# EAGLE design I2C Expansion Board v0.1A (EAGLE 9.3.1)
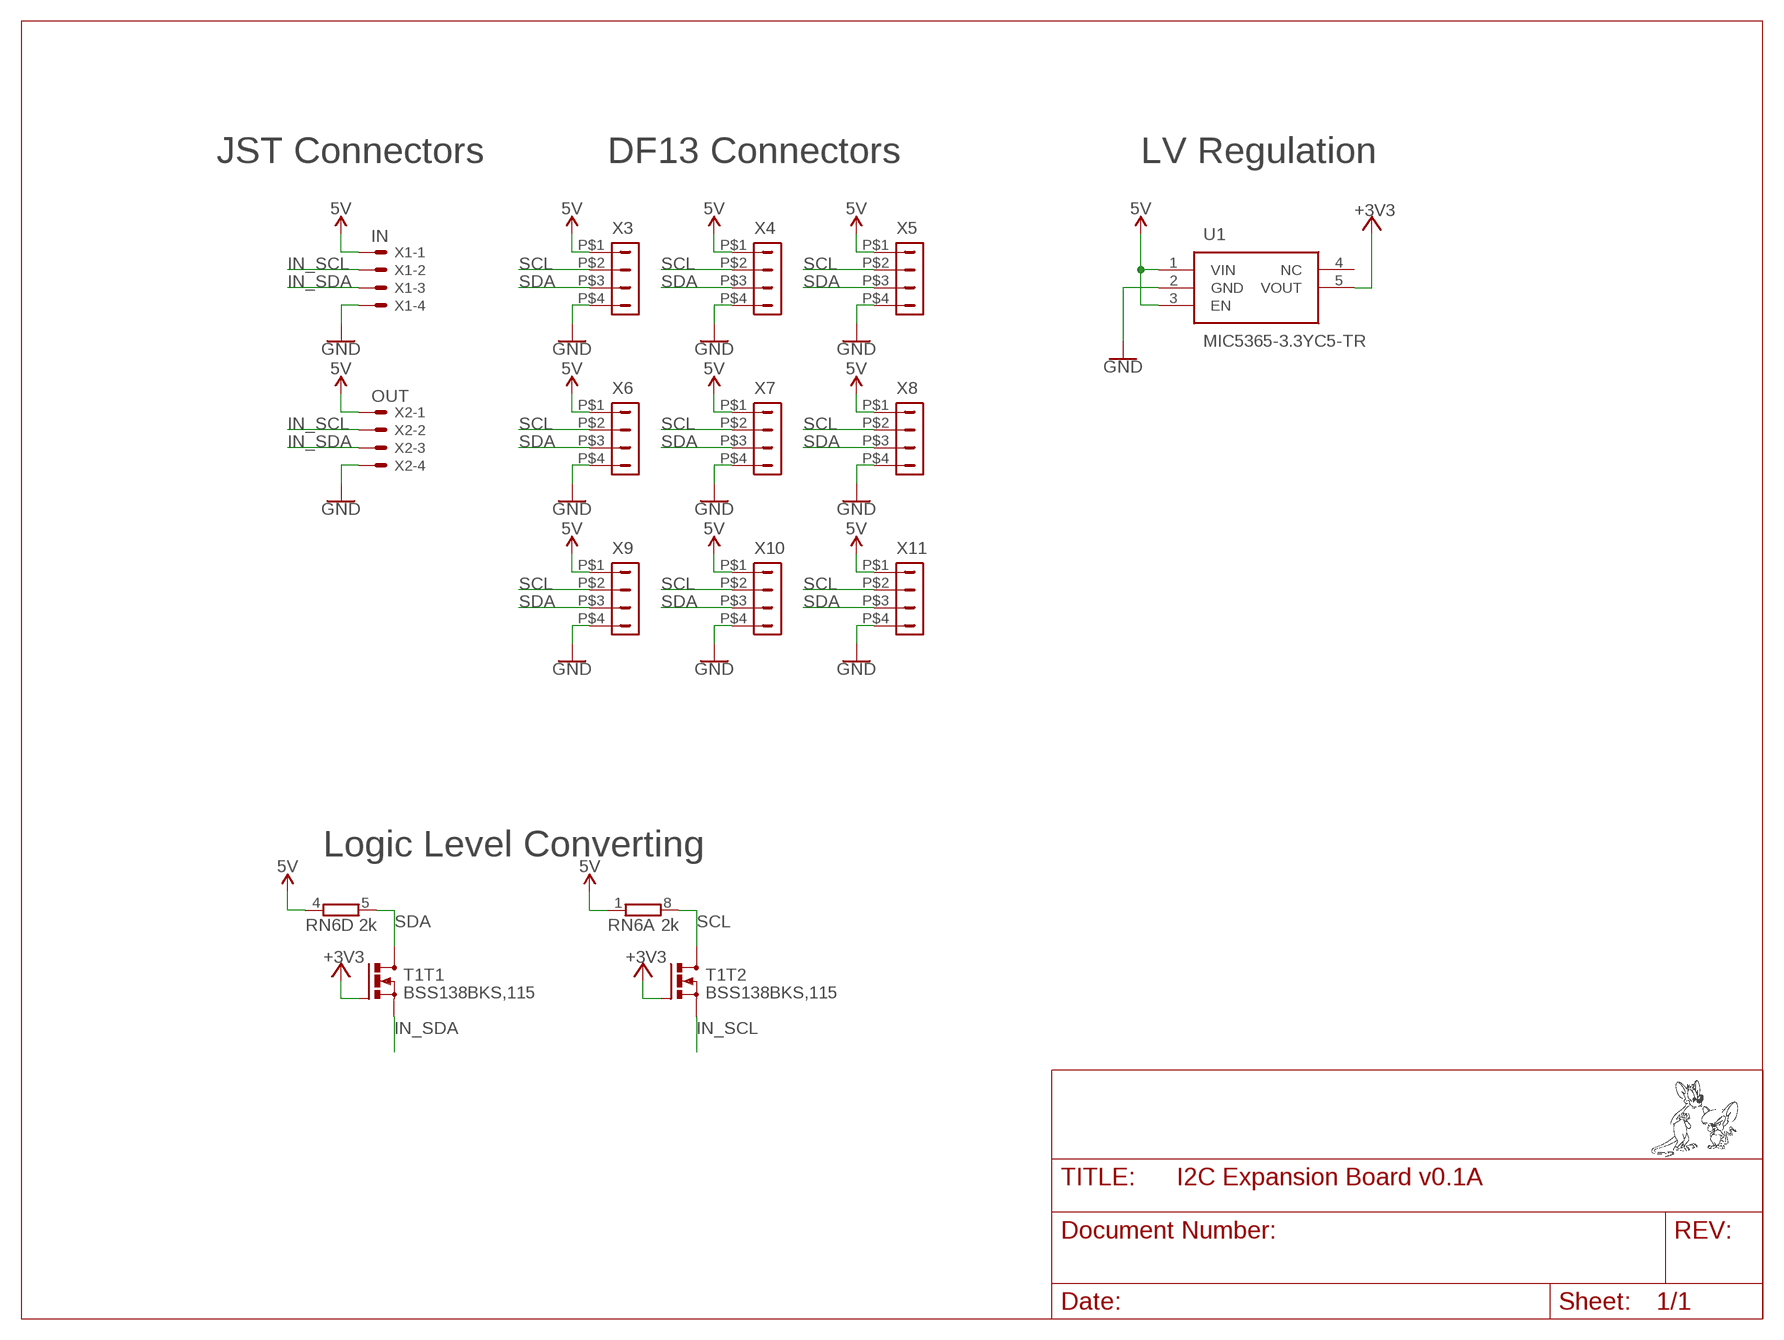
[diagram p0: schematic, sheet 1]

## Parts
RN6  2k  4R-NEXB28V  [EXB28V]
T1  BSS138BKS,115  [SOT363]
U1  MIC5365-3.3YC5-TR  [SOT65P210X110-5N]
X1  IN  JST-XH-04-PIN-LONG-PAD  [JST-XH-04-PACKAGE-LONG-PAD]
X2  OUT  JST-XH-04-PIN-LONG-PAD  [JST-XH-04-PACKAGE-LONG-PAD]
X3  DF13-4P-1.25DSA  [DF13-4P-1.25DSA]
X4  DF13-4P-1.25DSA  [DF13-4P-1.25DSA]
X5  DF13-4P-1.25DSA  [DF13-4P-1.25DSA]
X6  DF13-4P-1.25DSA  [DF13-4P-1.25DSA]
X7  DF13-4P-1.25DSA  [DF13-4P-1.25DSA]
X8  DF13-4P-1.25DSA  [DF13-4P-1.25DSA]
X9  DF13-4P-1.25DSA  [DF13-4P-1.25DSA]
X10  DF13-4P-1.25DSA  [DF13-4P-1.25DSA]
X11  DF13-4P-1.25DSA  [DF13-4P-1.25DSA]

## Nets
5V: RN6.1 RN6.4 U1.1(VIN) U1.3(EN) X1.1 X2.1 X3.P$1 X4.P$1 X5.P$1 X6.P$1 X7.P$1 X8.P$1 X9.P$1 X10.P$1 X11.P$1
+3V3: T1.2(T1:G) T1.5(T2:G) U1.5(VOUT)
GND: U1.2(GND) X1.4 X2.4 X3.P$4 X4.P$4 X5.P$4 X6.P$4 X7.P$4 X8.P$4 X9.P$4 X10.P$4 X11.P$4
IN_SCL: T1.4(T2:S) X1.2 X2.2
IN_SDA: T1.1(T1:S) X1.3 X2.3
SCL: RN6.8 T1.3(T2:D) X3.P$2 X4.P$2 X5.P$2 X6.P$2 X7.P$2 X8.P$2 X9.P$2 X10.P$2 X11.P$2
SDA: RN6.5 T1.6(T1:D) X3.P$3 X4.P$3 X5.P$3 X6.P$3 X7.P$3 X8.P$3 X9.P$3 X10.P$3 X11.P$3
Unconnected: RN6.2 RN6.3 RN6.6 RN6.7 U1.4(NC)

## Notes on the sheet
- JST Connectors | DF13 Connectors | LV Regulation
- Logic Level Converting

## Library data of the parts
RN6 = resistor-dil:4R-N: Array Chip Resistor Source: RS Component / Phycomp; OC_FARNELL: unknown; OC_NEWARK: unknown
T1 = BSS138BKS_115:BSS138BKS,115; AVAILABILITY: Unavailable; DESCRIPTION: Dual N-Channel 60 V 1.6 Ohm 445 mW 0.6 nC Surface Mount Trench MOSFET - TSSOP-6; MF: Nexperia USA; MP: BSS138BKS,115; PACKAGE: SOT-363 Nexperia; PRICE: None
U1 = MIC5365-3.3YC5-TR:MIC5365-3.3YC5-TR: MICROCHIP - MIC5365-3.3YC5-TR - LDO, FIXED, 3.3V, 0.15A, SC-70-5 Source: Datasheet <http://www.mouser.com/ds/2/268/mic5365-779177.pdf>; DESCRIPTION: MICROCHIP - MIC5365-3.3YC5-TR - LDO, FIXED, 3.3V, 0.15A, SC-70-5; HEIGHT: 1.1mm; MANUFACTURER_NAME: Microchip; MANUFACTURER_PART_NUMBER: MIC5365-3.3YC5-TR; MOUSER_PART_NUMBER: 998-MIC5365-3.3YC5TR; RS_PART_NUMBER: 1773258P; RS_PRICE-STOCK: http://uk.rs-online.com/web/p/products/1773258P
X1 X2 = Rembrandt Electronics - JST XH Connectors v1-0:JST-XH-04-PIN: JST XH Connector 2 Pin Wire to board connector. Pitch: 2,54 mm, (0.100") Number of pins: 4 Created by Rembrandt Electronics www.rembrandtelectronics.com
X3-X11 = con-hirose-df13:DF13-4P-1.25: DF13-4P 1.25mm Pitch Miniature Crimping Connector.

## Board
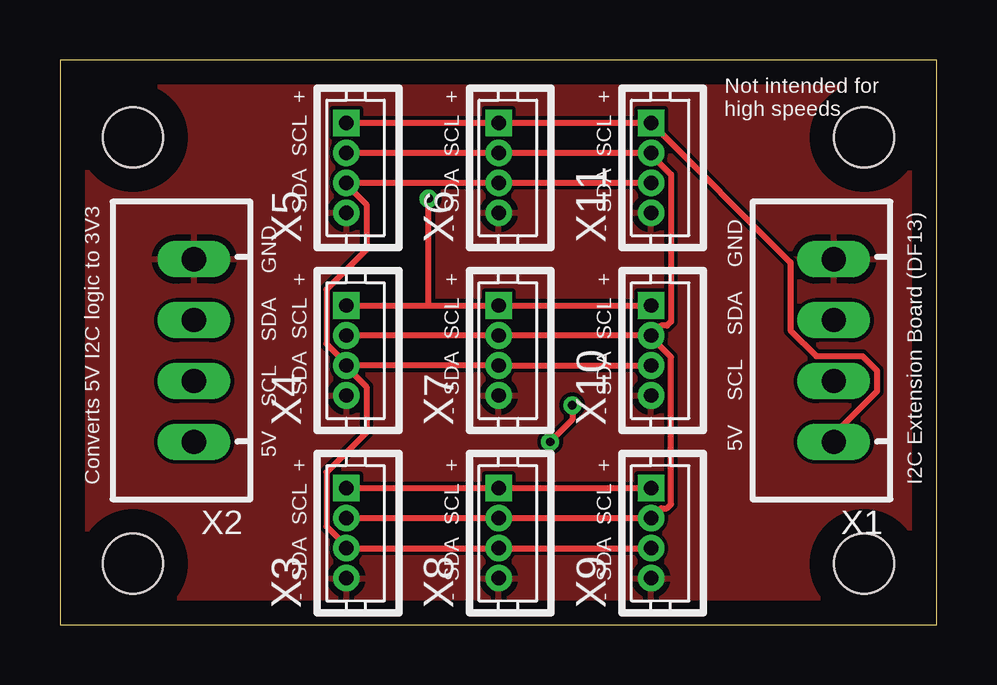
[diagram p1: board, top side]
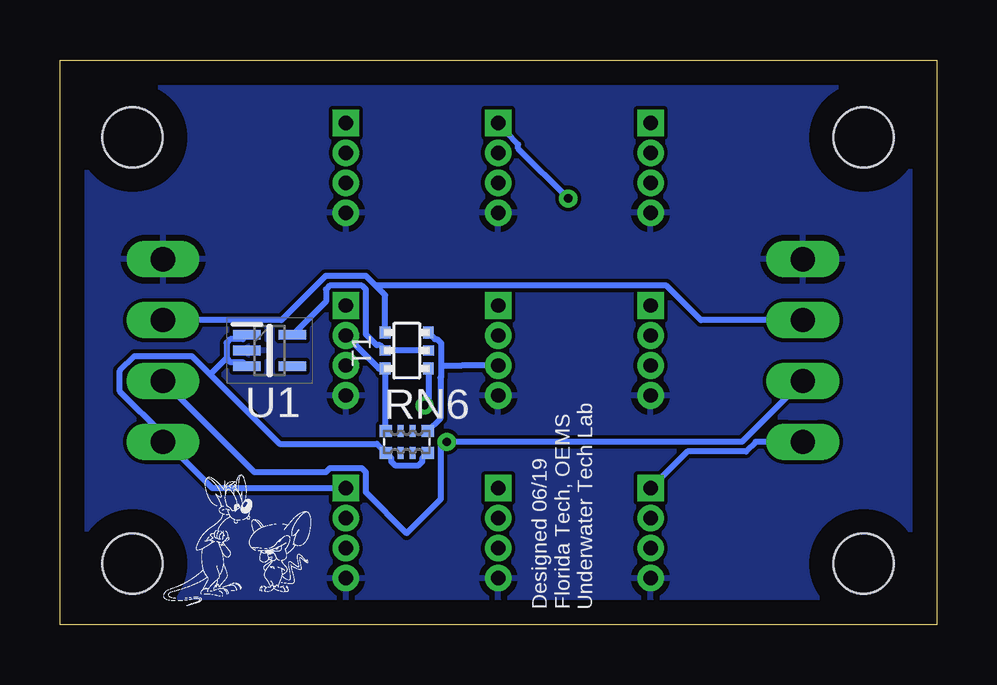
[diagram p2: board, bottom side, seen from below]

Size 36.56 x 23.55 mm. Coordinates in mm from the lower left corner, seen from the top.
Outline: 0,23.55 0,0 36.56,0 36.56,23.55 0,23.55
Copper layers (1*16): Top 0.035mm / dielectric 1.5mm / Bottom 0.035mm
Design rules "default": minimum track width 6mil, minimum drill 0.35mm, track to track 6mil, track to pad 6mil, pad to pad 6mil, via to via 6mil, smd to smd 6mil, copper to edge 40mil, drill to drill 6mil, minimum pad ring 10mil, minimum via ring 8mil, stop-mask expansion 4mil, vias tented up to drill 0mil, thermal gap 10mil
Holes 2.5 mm at 3.05,2.54 33.53,2.54 33.53,20.32 3.05,20.32

### Footprints (pad centres in the part's own frame; a part is rotated, then mirrored left to right if it is on the bottom)
EXB28V = smd 0.525 x 0.5: 1 -0.875,-0.45; 4 0.875,-0.45; 5 0.875,0.45; 8 -0.875,0.45 | smd 0.25 x 0.5: 2 -0.25,-0.45; 3 0.25,-0.45; 6 0.25,0.45; 7 -0.25,0.45
SOT363 = smd 0.5 x 0.5: 1 -0.9,0.75; 3 -0.9,-0.75; 4 0.9,-0.75; 6 0.9,0.75 | smd 0.5 x 0.4: 2 -0.9,0; 5 0.9,0
SOT65P210X110-5N = smd 1.15 x 0.4: 1 -0.95,0.65; 2 -0.95,0; 3 -0.95,-0.65; 4 0.95,-0.65; 5 0.95,0.65
JST-XH-04-PACKAGE-LONG-PAD = drill 1.016 long: 1 -3.81,0; 2 -1.27,0; 3 1.27,0; 4 3.81,0
DF13-4P-1.25DSA = drill 0.6 pad 1.016 square: P$1 1.875,0 | drill 0.6 pad 1.016: P$2 0.625,0; P$3 -0.625,0; P$4 -1.875,0

### Placement (x,y rotation side)
RN6  22.1,7.62 0 bottom
T1  22.1,11.43 0 bottom
U1  27.81,11.43 0 bottom
X1  32.26,11.43 90 top
X2  5.59,11.43 90 top
X3  11.94,3.81 90 top
X4  11.94,11.43 90 top
X5  11.94,19.05 90 top
X6  18.29,19.05 90 top
X7  18.29,11.43 90 top
X8  18.29,3.81 90 top
X9  24.64,3.81 90 top
X10  24.64,11.43 90 top
X11  24.64,19.05 90 top

### Tracks (layer width: path | path; a pad name or v marks a point on that pad's centre or on a via)
5V  (via drill 0.35)
  Top 0.254: X5.P$1 X6.P$1 X11.P$1 30.45,15.11 30.45,12.27 31.52,11.2 33.45,11.2 34.06,10.59 34.06,9.73 32.26,7.92 X1.1 | X9.P$1 X8.P$1 X3.P$1 | X4.P$1 15.37,13.3 | 15.37,13.3 X7.P$1 X10.P$1 | 15.37,13.3 v15.37,17.77
  Bottom 0.254: X1.1 32.26,7.75 | 32.26,7.75 32.26,7.92 34.06,9.73 34.06,10.59 33.45,11.2 31.06,11.2 30.31,10.45 | 30.31,10.45 27.4,7.54 23.34,7.54 RN6.1 22.75,6.95 22.75,6.8 22.59,6.64 21.61,6.64 21.44,6.8 21.44,6.95 RN6.4 | 29.62,11.11 29.62,11.75 29.45,11.91 28.93,11.91 U1.1 | 29.62,11.11 29.45,10.95 28.93,10.95 U1.3 | 29.62,11.11 30.28,10.45 30.31,10.45 | X2.1 7.55,7.62 7.96,7.21 10.41,7.21 X3.P$1 | X9.P$1 30.2,5.68 32.26,7.75 | X6.P$1 18.29,20.69 18.11,20.51 17.94,20.51 17.45,20.02 17.45,19.86 v15.37,17.77
+3V3
  Bottom 0.254: U1.5 25.47,13.47 25.47,13.97 25.31,14.14 23.97,14.14 23.8,13.97 23.8,12.11 23.35,11.65 23.22,11.65 T1.2 T1.5
GND
  pour Top: 0,23.5 36.58,23.5 36.58,0 0,0
  pour Bottom: 0,23.5 0,0 36.58,0 36.58,23.5
IN_SCL  (via drill 0.35)
  Top 0.254: v21.36,9.14 21.36,8.55 v20.43,7.62
  Bottom 0.254: X1.2 28.45,6.35 25.48,6.35 25.31,6.52 23.97,6.52 23.8,6.36 23.8,5.52 22.1,3.81 20.68,5.23 20.68,7.62 v20.43,7.62 8.13,7.62 X2.2 | T1.4 21.2,9.3 v21.36,9.14
IN_SDA
  Bottom 0.254: 23.39,14.14 23.8,14.54 25.48,14.54 27.32,12.7 X1.3 | X2.3 9.83,12.7 11.27,14.14 23.39,14.14 | T1.1 23,13.74 23.39,14.14
SCL
  Top 0.254: X3.P$2 X8.P$2 X9.P$2 25.05,4.85 25.31,4.85 25.47,5.01 25.47,11.15 24.64,11.98 X10.P$2 | X5.P$2 X6.P$2 X11.P$2 24.64,19.6 25.47,18.77 25.47,12.63 25.31,12.47 25.05,12.47 X10.P$2 | X10.P$2 X7.P$2 X4.P$2
  Bottom 0.254: RN6.8 23,8.1 T1.3 23.26,10.68 X10.P$2
SDA
  Top 0.254: X10.P$3 X7.P$3 X4.P$3 | X11.P$3 X6.P$3 X5.P$3 11.94,18.35 12.77,17.52 12.77,15.64 11.11,13.97 11.11,11.71 11.94,10.88 X4.P$3 | X9.P$3 X8.P$3 X3.P$3 11.94,3.26 11.11,4.09 11.11,6.36 12.77,8.02 12.77,9.9 11.94,10.73 X4.P$3
  Bottom 0.254: X7.P$3 19.82,10.8 19.83,10.79 20.67,10.79 | T1.6 20.93,11.91 20.84,11.91 20.67,11.73 20.67,10.79 | 20.67,10.79 20.67,10.33 20.7,10.3 20.7,8.59 RN6.5

### Text on the board
tSilk: Not intended for / high speeds | - SDA SCL + | - SDA SCL + | - SDA SCL + | - SDA SCL + | - SDA SCL + | - SDA SCL + | 5V SCL SDA GND | 5V SCL SDA GND | Converts 5V I2C logic to 3V3 | I2C Extension Board (DF13) | - SDA SCL + | - SDA SCL + | - SDA SCL +
_bsilk: Designed 06/19 / Florida Tech, OEMS / Underwater Tech Lab